# Altium schematic sheet LCD.SchDoc
size A
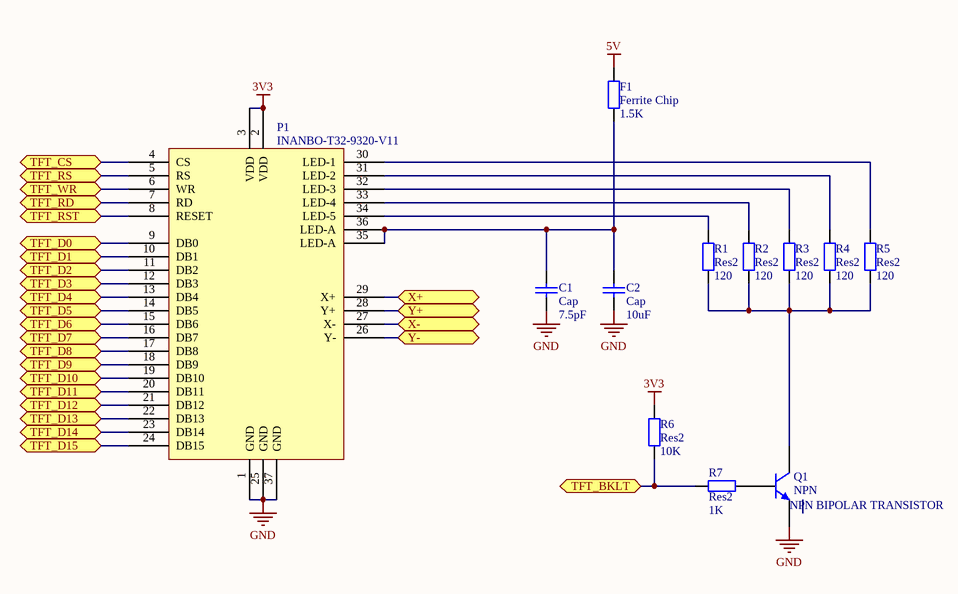
[diagram p0: LCD.SchDoc]

## Parts
C1  Cap  value 7.5pF  [0603]
C2  Cap  value 10uF  [0805]
F1  Ferrite Chip  value 1.5K  [0603]
P1  INANBO-T32-9320-V11  [INANBO-T32-ILI9320-V11]
Q1  NPN  value NPN BIPOLAR TRANSISTOR  [SOT23_M]
R1  Res2  value 120  [0603]
R2  Res2  value 120  [0603]
R3  Res2  value 120  [0603]
R4  Res2  value 120  [0603]
R5  Res2  value 120  [0603]
R6  Res2  value 10K  [0603]
R7  Res2  value 1K  [0603]

## Ports
TFT_BKLT, TFT_CS, TFT_D0, TFT_D1, TFT_D2, TFT_D3, TFT_D4, TFT_D5, TFT_D6, TFT_D7, TFT_D8, TFT_D9, TFT_D10, TFT_D11, TFT_D12, TFT_D13, TFT_D14, TFT_D15, TFT_RD, TFT_RS, TFT_RST, TFT_WR, X+, X-, Y+, Y-

## Nets
3V3: P1.2(VDD) P1.3(VDD) R6.2
5V: F1.1
GND: C1.1 C2.1 P1.1(GND) P1.25(GND) P1.37(GND) Q1.3(E)
TFT_BKLT: R6.1 R7.2 ; port TFT_BKLT
TFT_CS: P1.4(CS) ; port TFT_CS
TFT_D0: P1.9(DB0) ; port TFT_D0
TFT_D1: P1.10(DB1) ; port TFT_D1
TFT_D2: P1.11(DB2) ; port TFT_D2
TFT_D3: P1.12(DB3) ; port TFT_D3
TFT_D4: P1.13(DB4) ; port TFT_D4
TFT_D5: P1.14(DB5) ; port TFT_D5
TFT_D6: P1.15(DB6) ; port TFT_D6
TFT_D7: P1.16(DB7) ; port TFT_D7
TFT_D8: P1.17(DB8) ; port TFT_D8
TFT_D9: P1.18(DB9) ; port TFT_D9
TFT_D10: P1.19(DB10) ; port TFT_D10
TFT_D11: P1.20(DB11) ; port TFT_D11
TFT_D12: P1.21(DB12) ; port TFT_D12
TFT_D13: P1.22(DB13) ; port TFT_D13
TFT_D14: P1.23(DB14) ; port TFT_D14
TFT_D15: P1.24(DB15) ; port TFT_D15
TFT_RD: P1.7(RD) ; port TFT_RD
TFT_RS: P1.5(RS) ; port TFT_RS
TFT_RST: P1.8(RESET) ; port TFT_RST
TFT_WR: P1.6(WR) ; port TFT_WR
X+: P1.29(X+) ; port X+
X-: P1.27(X-) ; port X-
Y+: P1.28(Y+) ; port Y+
Y-: P1.26(Y-) ; port Y-
NetC1_2: C1.2 C2.2 F1.2 P1.35(LED-A) P1.36(LED-A)
NetP1_30: P1.30(LED-1) R5.2
NetP1_31: P1.31(LED-2) R4.2
NetP1_32: P1.32(LED-3) R3.2
NetP1_33: P1.33(LED-4) R2.2
NetP1_34: P1.34(LED-5) R1.2
NetQ1_1: Q1.1(C) R1.1 R2.1 R3.1 R4.1 R5.1
NetQ1_2: Q1.2(B) R7.1

## Library data of the parts
C1 C2 = Cap: Capacitor; Supplier 1: Digi-Key
  C1: Supplier Part Number 1: 490-3565-1-ND
  C2: Supplier Part Number 1: 445-6857-1-ND
F1 = Res2: Supplier 1: Digi-Key; Supplier Part Number 1: 490-5216-1-ND
P1 = ER-TFT032-2: 3.2" TFT LCD module with touch panel; Supplier 1: INANBO; Supplier Part Number 1: INANBO-T32-9320-V11
Q1 = NPN: NPN Bipolar Transistor; pin to pad: 2>3 3>2; Supplier Part Number 1: MMBT2222ALT3GOSCT-ND; Supplier 1: Digi-Key
R1-R7 = Res2: Resistor; Supplier 1: Digi-Key
  R1-R5: Supplier Part Number 1: P120GCT-ND
  R6: Supplier Part Number 1: P10KGCT-ND
  R7: Supplier Part Number 1: 311-1.0KGRCT-ND